# Altium schematic sheet DCAC_V2.SchDoc (part 2 of 3)
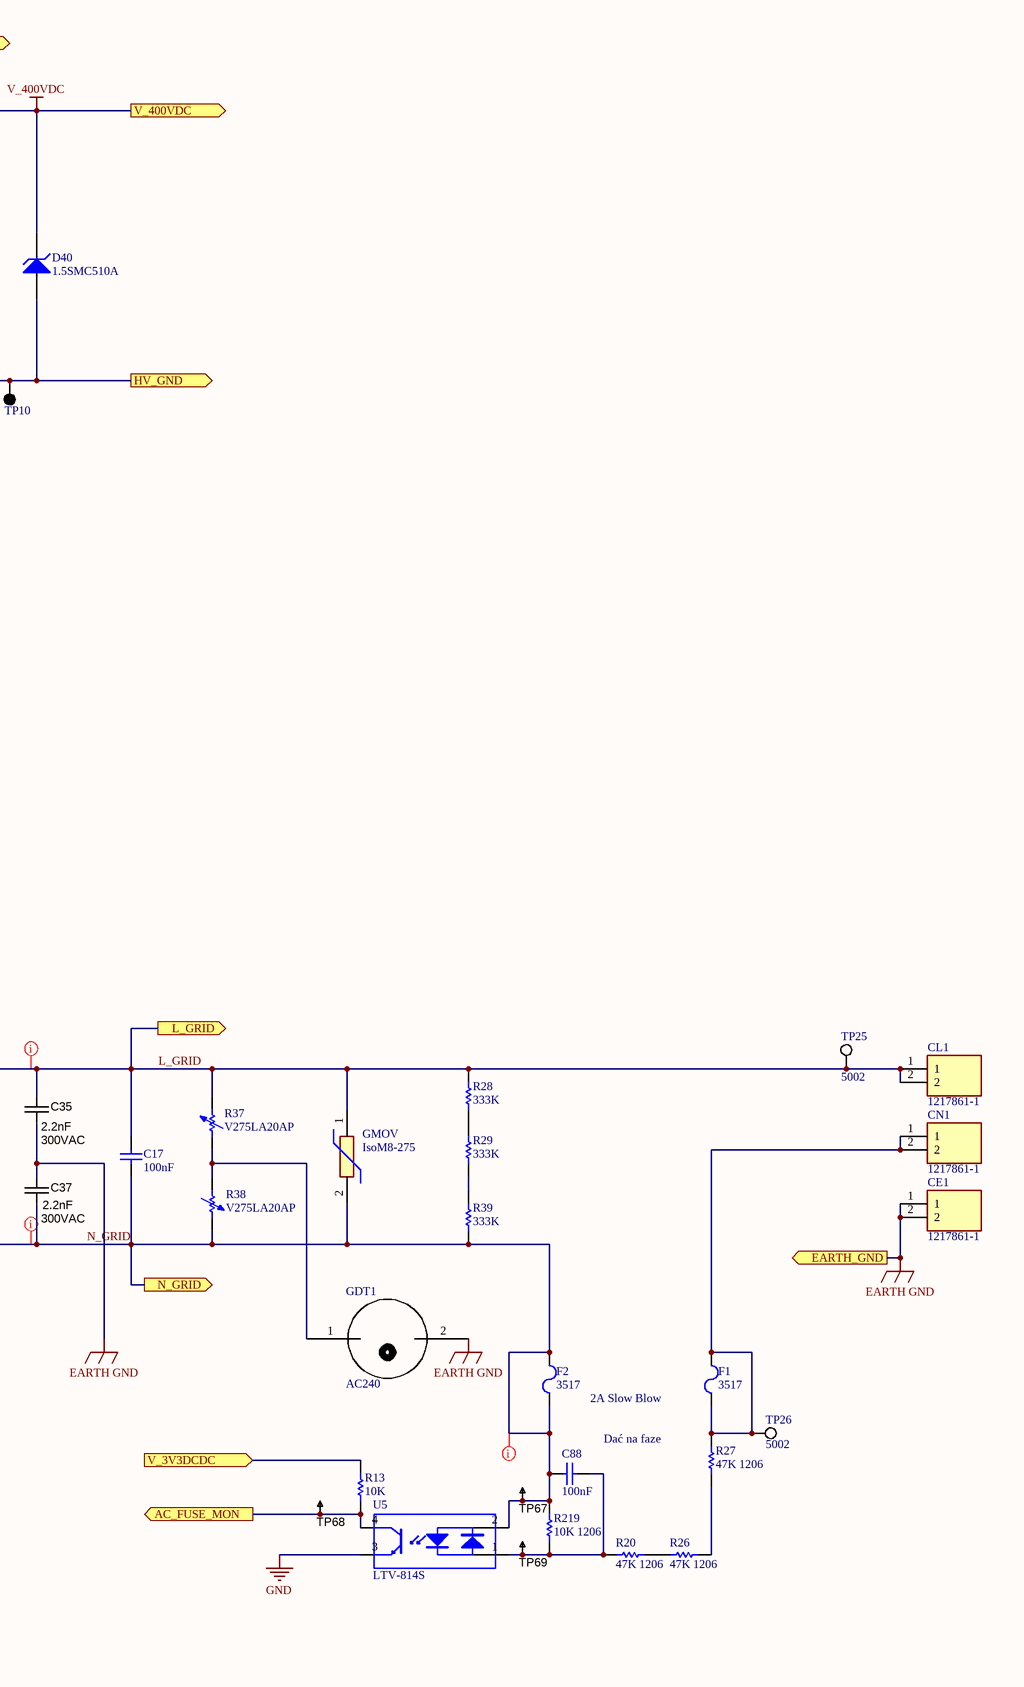
[diagram p2: DCAC_V2.SchDoc, right]
## Library data of the parts
C1-C4 = CAPMF_330n_TH_MPET_63VDC_10%: ECW-FE2W105K; Manufacturer: Panasonic; Manufacturer Part Number: ECWFE2W335J; Dielectric Material: PP; Tolerance: 5%; Supplier 1: Farnell; Supplier Part Number 1: 2805922; Stock 1: 358; RoHS: Yes; Mount: Through Hole; Case/Package: Radial; Min Operating Temperature: -40°C; Max Operating Temperature: 105°C; Packaging: Bulk; Capacitance: 1uF; Termination: PC Pins; Length: 1.024inch; Width: 0.394inch; Height - Seated (Max): 0.67inch; Lead Pitch: 0.886inch; ComponentLink1URL: https://industrial.panasonic.com/cdbs/www-data/pdf/RDI0000/DMI0000COL72.pdf?src-supplier=Digi-Key; ComponentLink1Description: https://industrial.panasonic.com/cdbs/www-data/pdf/RDI0000/DMI0000COL72.pdf?src-supplier=Digi-Key
C5 = C4AQLLW5360M36K: Capacitor; Manufacturer_Name: Kemet; Datasheet Link: https://www.kemet.com/specsheet/C4AQLLW5360M36K; Height: 24.2mm; Manufacturer_Part_Number: C4AQLLW5360M36K
C6 = CAPMF_330n_TH_MPET_63VDC_10%: Capacitor THD Metallized PP 45 uF, 500 VDC, -55/+105°C; Manufacturer: KEMET; Value: 45uF; ComponentLink1URL: http://www.epcos.com/inf/20/20/db/fc_2009/MKT_B32520_529.pdf; ComponentLink1Description: http://www.epcos.com/inf/20/20/db/fc_2009/MKT_B32520_529.pdf; Supplier 1: Newark; Supplier Part Number 1: 82AH0176; Manufacturer Part Number: C4AQLLW5450A38K; RoHS: Yes
C9 C149 = CMP-2006-02595-1: C0G ±5% 50V 100pF 0603 Multilayer Ceramic Capacitors MLCC - SMD/SMT ROHS; Part Number: GRM1885C1H101JA01D; Manufacturer: Murata; Temperature Coefficient: 30ppm/°C; Insulation Resistance: 10GR; Supplier 1: Digi-Key; Supplier Part Number 1: 490-1427-1-ND; Manufacturer Part Number: GRM1885C1H101JA01D; RoHS: Yes; Category: Ceramic Capacitors; Stock 1: 98306; Pricing 1: 1=0.10000, 10=0.06100, 50=0.03320, 100=0.02700, 500=0.01932, 1000=0.01518 (USD); Mount: Surface Mount; Case/Package: 0603; Number of Pins: 2; Case Code (Metric): 1608; Case Code (Imperial): 0603; Dielectric Material: Ceramic; Weight: 7.1E-05oz; Material: Ceramic; Min Operating Temperature: -55°C; Max Operating Temperature: 125°C; Capacitance: 100pF; Voltage Rating: 50V; Tolerance: 5%; Packaging: Tape and Reel; Package Quantity: 1; Voltage Rating (DC): 50V; Dielectric: C0G; Termination: SMD/SMT; Voltage: 50V; Length: 1.6mm; Width: 0.031inch; Height: 0.8mm; Thickness: 0.035inch; Depth: 0.8mm; Radiation Hardening: No; RoHS Compliant: Yes; REACH SVHC: Unknown; Lead Free: Lead Free; ComponentLink1URL: https://datasheet.ciiva.com/131/product-131088.pdf?src-supplier=Digi-Key; ComponentLink1Description: https://datasheet.ciiva.com/131/product-131088.pdf?src-supplier=Digi-Key; ComponentLink2URL: https://datasheet.ciiva.com/18100/getdatasheetpartid-26823-18100641.pdf?src-supplier=Verical; ComponentLink2Description: https://datasheet.ciiva.com/18100/getdatasheetpartid-26823-18100641.pdf?src-supplier=Verical; ComponentLink3URL: https://datasheet.ciiva.com/3777/grm1885c1h101ja0123-3777264.pdf?src-supplier=Arrow+Electronics; ComponentLink3Description: https://datasheet.ciiva.com/3777/grm1885c1h101ja0123-3777264.pdf?src-supplier=Arrow+Electronics; ComponentLink4URL: https://datasheet.ciiva.com/29149/450134-da-01-en-vs-kondensator-0603-29149008.pdf?src-supplier=Conrad; ComponentLink4Description: https://datasheet.ciiva.com/29149/450134-da-01-en-vs-kondensator-0603-29149008.pdf?src-supplier=Conrad; ComponentLink5URL: https://datasheet.ciiva.com/131/partnumbering-e-01-131089.pdf?src-supplier=Digi-Key; ComponentLink5Description: https://datasheet.ciiva.com/131/partnumbering-e-01-131089.pdf?src-supplier=Digi-Key; ComponentLink6URL: https://datasheet.ciiva.com/11605/c02e-11605557.pdf?src-supplier=Avnet; ComponentLink6Description: https://datasheet.ciiva.com/11605/c02e-11605557.pdf?src-supplier=Avnet; ComponentLink7URL: https://datasheet.ciiva.com/28556/4360-28556551.pdf?src-supplier=Element14; ComponentLink7Description: https://datasheet.ciiva.com/28556/4360-28556551.pdf?src-supplier=Element14; ComponentLink8URL: https://datasheet.ciiva.com/7828/4360-7828889.pdf?src-supplier=Element14; ComponentLink8Description: https://datasheet.ciiva.com/7828/4360-7828889.pdf?src-supplier=Element14; ComponentLink9URL: https://datasheet.ciiva.com/7828/4360-7828890.pdf?src-supplier=Element14; ComponentLink9Description: https://datasheet.ciiva.com/7828/4360-7828890.pdf?src-supplier=Element14; ComponentLink10URL: https://datasheet.ciiva.com/7828/4360-7828891.pdf?src-supplier=Element14; ComponentLink10Description: https://datasheet.ciiva.com/7828/4360-7828891.pdf?src-supplier=Element14; ComponentLink11URL: https://datasheet.ciiva.com/14116/grmseries-tc-hitype-eng-14116828.pdf?src-supplier=Distrelec; ComponentLink11Description: https://datasheet.ciiva.com/14116/grmseries-tc-hitype-eng-14116828.pdf?src-supplier=Distrelec; ComponentLink12URL: https://datasheet.ciiva.com/16291/product-16291613.pdf?src-supplier=Future+Electronics; ComponentLink12Description: https://datasheet.ciiva.com/16291/product-16291613.pdf?src-supplier=Future+Electronics; ComponentLink13URL: https://datasheet.ciiva.com/131/partnumbering-e-01-131087.pdf?src-supplier=Digi-Key; ComponentLink13Description: https://datasheet.ciiva.com/131/partnumbering-e-01-131087.pdf?src-supplier=Digi-Key; ComponentLink14URL: https://datasheet.ciiva.com/14116/grmseries-tc-hitype-eng-14116815.pdf?src-supplier=Distrelec; ComponentLink14Description: https://datasheet.ciiva.com/14116/grmseries-tc-hitype-eng-14116815.pdf?src-supplier=Distrelec; JLCPCB Part #: C14858
C10 = CMP-2000-07534-1: Chip Capacitor, 10 uF, +/- 20%, 100 V, -55 to 125 degC, 2220 (5750 Metric), RoHS, Tape and Reel; Manufacturer: AVX; Manufacturer Part Number: 22201C106MAT2A; Capacitance: 10uF; Voltage Rating: 100V; Dielectric: X7R; Datasheet URL: http://datasheets.avx.com/X7RDielectric.pdf; Package Reference: 2220; Package Description: 2-Pin Surface Mount Device, Body 5 x 5.7 mm; Datasheet Version: 03/2017; Manufacturer URL: http://www.avx.com/; Mounting Technology: SurfaceMount; Supplier 1: Digi-Key; Supplier Part Number 1: 478-9622-1-ND; Stock 1: 129916; Pricing 1: 1=2,26000, 10=1,82600, 100=1,39470 (USD); RoHS: Yes; Mount: Surface Mount; Case/Package: 2220; Case Code (Metric): 5750; Case Code (Imperial): 2220; Min Operating Temperature: -55°C; Max Operating Temperature: 125°C; Packaging: Tape and Reel; Tolerance: 20%; Voltage Rating (DC): 100V; Length: 0.224inch; Width: 0.197inch; Thickness: 0.11inch; ComponentLink1URL: http://catalogs.avx.com/SurfaceMount.pdf?src-supplier=Digi-Key; ComponentLink1Description: http://catalogs.avx.com/SurfaceMount.pdf?src-supplier=Digi-Key
C16 C17 = CMP-2000-05891-1: EMI Suppression Capacitor (MKP), 0.1 uF, +/- 10%, 305 V, 2-Pin THD, RoHS, Bulk B32922C3104K; Manufacturer: TDK; Other Names: 495-4476; Dielectric Material: Polypropylene; Voltage Rating - DC: 630V; Capacitance: 0.1µF; Dynamic Catalog: B32922Series; Voltage Rating - AC: 305V; Family: FilmCapacitors; Package / Case: Radial; Datasheet Version: 09/2016; Mounting Technology: ThroughHole; Package Reference: B32922C3104K; Datasheet URL: https://en.tdk.eu/inf/20/20/db/fc_2009/X2_B32921_928.pdf; Height - Seated (Max): 0.413"(10.50mm); Applications: EMISuppressionX2; Standard Package: 4,000; Package Description: 2-Pin Through Hole Device, Body 18 x 5 mm, Pitch 15 mm; Features: EMISuppression; Mounting Type: ThroughHole; Series: B32922; Category: Capacitors; Termination: PCPins; Size / Dimension: 0.709"Lx0.197"W(18.00mmx5.00mm); Operating Temperature: -40°C~110°C; Packaging: Bulk; Manufacturer URL: http://www.tdk.com/; Tolerance: ±10%; Lead Spacing: 0.591"(15.00mm)
C33 = CAPMF_330n_TH_MPET_63VDC_10%: MPX564K305G; Manufacturer 1: EPCOS Inc; Manufacturer Part Number 1: ECW-FE2W475P; Tolerance: ±10%; Material: Metallized Polyester; SCDType: source; Package / Case: Radial; Operating Temperature: -55°C ~ 125°C; ComponentLink1URL: http://www.epcos.com/inf/20/20/db/fc_2009/MKT_B32520_529.pdf; ComponentLink1Description: http://www.epcos.com/inf/20/20/db/fc_2009/MKT_B32520_529.pdf; Supplier 1: Digi-Key; Supplier Part Number 1: 495-2548-ND; Height - Seated (Max): 6.50mm; Lead Spacing: 5.00mm; Size / Dimension: 7.20mm L x 3.00mm W max; Value: 560nF
C35 C37 C188 C189 = CAPMF_330n_TH_MPET_63VDC_10%: B32021A3222K289; Manufacturer 1: EPCOS Inc; Manufacturer Part Number 1: ECW-FE2W475P; Tolerance: ±10%; Material: Metallized Polyester; SCDType: source; Package / Case: Radial; Operating Temperature: -55°C ~ 125°C; ComponentLink1URL: http://www.epcos.com/inf/20/20/db/fc_2009/MKT_B32520_529.pdf; ComponentLink1Description: http://www.epcos.com/inf/20/20/db/fc_2009/MKT_B32520_529.pdf; Supplier 1: Digi-Key; Supplier Part Number 1: 495-2548-ND; Height - Seated (Max): 6.50mm; Lead Spacing: 5.00mm; Size / Dimension: 7.20mm L x 3.00mm W max; Value: 2.2nF
C38 = CAP-NP-2: X5R ±10% 50V 10uF 1206 Multilayer Ceramic Capacitors MLCC - SMD/SMT ROHS; Manufacturer: AVX; Rated Voltage: 25V; Capacitance: 10µF; Mounting Technology: SurfaceMount; Package Reference: 1206; Tolerance (%): ±10%; Manufacturer URL: http://www.avx.com/; Datasheet URL: http://datasheets.avx.com/cx5r.pdf; Package Description: 2-Pin Surface Mount Device, Body 3.2 x 1.6 mm; Dielectric: X5R; Datasheet Version: 05/2016; Case Size/Dimension: 1206; JLCPCB Part #: C13585
C86 = CAP: X7R 1nF ±10% 50V 0603 Multilayer Ceramic Capacitors MLCC - SMD/SMT ROHS; Manufacturer: AVX Interconnect / Elco; Part Number: 06035A151JAT2A.; Manufacturer Part Number: 06035A151JAT2A; Capacitance: 100pF; Tolerance: 5%; Dielectric: C0G; Temperature Coefficient: 30ppm/°C; Insulation Resistance: 100GR; Supplier 1: Digi-Key; Supplier Part Number 1: 478-1177-1-ND; RoHS: Yes; Category: Ceramic Capacitors; Stock 1: 63714; Pricing 1: 1=0.12000, 10=0.08900, 100=0.04180, 500=0.02932, 1000=0.02428 (USD); Mount: Surface Mount,PCB; Case/Package: 0603; Number of Pins: 2; Case Code (Metric): 1608; Case Code (Imperial): 0603; Dielectric Material: Ceramic; Contact Plating: Tin,Matte; Min Operating Temperature: -55°C; Max Operating Temperature: 125°C; Voltage Rating (DC): 50V; Voltage Rating: 50V; Packaging: Tape and Reel; Package Quantity: 1; Termination: SMD/SMT; Voltage: 50V; Length: 1.6mm; Height: 0.86mm; Width: 0.032inch; Depth: 0.81mm; Thickness: 0.035inch; Radiation Hardening: No; Lead Free: Lead Free; REACH SVHC: No SVHC; ComponentLink1URL: https://datasheet.ciiva.com/1124/84496-1124721.pdf?src-supplier=Element14; ComponentLink1Description: https://datasheet.ciiva.com/1124/84496-1124721.pdf?src-supplier=Element14; ComponentLink2URL: https://datasheet.ciiva.com/2987/ccog-2987781.pdf?src-supplier=Avnet; ComponentLink2Description: https://datasheet.ciiva.com/2987/ccog-2987781.pdf?src-supplier=Avnet; ComponentLink3URL: https://datasheet.ciiva.com/7855/759117-7855061.pdf?src-supplier=Element14; ComponentLink3Description: https://datasheet.ciiva.com/7855/759117-7855061.pdf?src-supplier=Element14; ComponentLink4URL: https://datasheet.ciiva.com/2987/ccog-2987782.pdf?src-supplier=Avnet; ComponentLink4Description: https://datasheet.ciiva.com/2987/ccog-2987782.pdf?src-supplier=Avnet; ComponentLink5URL: https://datasheet.ciiva.com/156/ccog-156216.pdf?src-supplier=Digi-Key; ComponentLink5Description: https://datasheet.ciiva.com/156/ccog-156216.pdf?src-supplier=Digi-Key; ComponentLink6URL: https://datasheet.ciiva.com/156/ccog-156217.pdf?src-supplier=Digi-Key; ComponentLink6Description: https://datasheet.ciiva.com/156/ccog-156217.pdf?src-supplier=Digi-Key; ComponentLink7URL: https://datasheet.ciiva.com/156/ccog-156218.pdf?src-supplier=Digi-Key; ComponentLink7Description: https://datasheet.ciiva.com/156/ccog-156218.pdf?src-supplier=Digi-Key; ComponentLink8URL: https://datasheet.ciiva.com/16300/ccog-16300429.pdf?src-supplier=Future+Electronics; ComponentLink8Description: https://datasheet.ciiva.com/16300/ccog-16300429.pdf?src-supplier=Future+Electronics; ComponentLink9URL: https://datasheet.ciiva.com/22699/84496-22699966.pdf?src-supplier=Element14; ComponentLink9Description: https://datasheet.ciiva.com/22699/84496-22699966.pdf?src-supplier=Element14; ComponentLink10URL: https://datasheet.ciiva.com/5418/ccog-5418335.pdf?src-supplier=Mouser; ComponentLink10Description: https://datasheet.ciiva.com/5418/ccog-5418335.pdf?src-supplier=Mouser; ComponentLink11URL: https://datasheet.ciiva.com/16538/ccog-16538111.pdf?src-supplier=Avnet+Asia; ComponentLink11Description: https://datasheet.ciiva.com/16538/ccog-16538111.pdf?src-supplier=Avnet+Asia; Parameter 1: *; JLCPCB Part #: C1588; Parameter 2: *
C88 C116 = CAP: X7R 100nF ±10% 50V 0603 Multilayer Ceramic Capacitors MLCC - SMD/SMT ROHS; Part Number: GCM188R72A104KA64D; Manufacturer: Murata; Manufacturer Part Number: CC0603KRX7R9BB104; Voltage Rating: 100V; Supplier 1: Arrow Electronics; Supplier Part Number 1: GCM188R72A104KA64D; RoHS: Yes; Category: Ceramic Capacitors; Mount: Surface Mount; Case/Package: 0603; Case Code (Imperial): 0603; Case Code (Metric): 1608; Min Operating Temperature: -55°C; Max Operating Temperature: 125°C; Tolerance: 10%; Packaging: Tape and Reel; Capacitance: 100nF; Dielectric: X7R; Termination: SMD/SMT; Voltage Rating (DC): 100V; Length: 1.6mm; Height: 0.8mm; Depth: 0.8mm; Radiation Hardening: No; ComponentLink1URL: https://datasheet.ciiva.com/17451/product-17451047.pdf?src-supplier=Avnet+Europe; ComponentLink1Description: https://datasheet.ciiva.com/17451/product-17451047.pdf?src-supplier=Avnet+Europe; ComponentLink2URL: https://datasheet.ciiva.com/26889/getdatasheetpartid-387765-26889164.pdf?src-supplier=Verical; ComponentLink2Description: https://datasheet.ciiva.com/26889/getdatasheetpartid-387765-26889164.pdf?src-supplier=Verical; Parameter 1: *; JLCPCB Part #: C14663
C134 C187 = CAP: CAP 100nF 630V ±10% 1812 (4532 Metric) Thickness 2.3mm SMD; Case-Metric: 4532; Case-EIA: 1812; Tolerance: Â±10%; Value: 100nF; Rated Voltage: 630 V; Max Thickness: 2.3 mm; Technology: SMT
CE1 CL1 CN1 = 1217861-1: Connector; Manufacturer_Name: TE Connectivity; Datasheet Link: http://docs-emea.rs-online.com/webdocs/1278/0900766b812785e3.pdf; Manufacturer_Part_Number: 1217861-1; Mouser Part Number: 571-1217861-1; Mouser Price/Stock: https://www.mouser.co.uk/ProductDetail/TE-Connectivity-AMP/1217861-1/?qs=YkfQu37F2pOh5mJSH68dJA%3D%3D; Arrow Part Number: 1217861-1; Arrow Price/Stock: https://www.arrow.com/en/products/1217861-1/te-connectivity
CMC1 = CMC_2K2_100M_3216-SMD: Common Mode Choke 2.2K Ohm 1206 SMD; Manufacturer 1: Wurth Electronics Inc; Manufacturer Part Number 1: 744232222; Impedance: 2200 Ohm at 100 MHz; Ratings: 2.2k Ohms at 100MHz; SCDType: source; PackageDescription: SMD Inductor, 4-Leads, Body 1.8 x 3.4 mm; Supplier 1: Digi-Key; Supplier Part Number 1: 732-1474-1-ND; ComponentLink1URL: http://katalog.we-online.de/kataloge/eisos/media/pdf/744232222.pdf; ComponentLink1Description: 744232222 datasheet; Package / Case: Horizontal, 4 PC Pad; Height (Max): 0.083" (2.10mm)
D3 D4 = CMP-1161-00003-1: 3rd Generation ThinQ SiC Schottky Diode, -55 to 175 degC, PG-TO220-2-1, Tube, Green; Manufacturer: Infineon; ComponentLink1Description: Manufacturer URL; ComponentLink2Description: Datasheet; ComponentLink3URL: http://www.infineon.com/dgdl/IDP09E120_v2_3G%5B1%5D.pdf?folderId=db3a304314dca38901151224afae0c96&fileId=db3a30432313ff5e01237a7d849d7c11; ComponentLink1URL: http://www.infineon.com/; ComponentLink3Description: Package Specification; ComponentLink2URL: http://www.infineon.com/dgdl/IDH06SG60C_rev2.4.pdf?folderId=db3a30431ddc9372011ed0010fda1bd3&fileId=db3a30431ed1d7b2011eee0cadfb545a; Supplier 1: Digi-Key; Supplier Part Number 1: IDH06G65C6XKSA1-ND; Manufacturer Part Number: IDH06G65C6XKSA1; Stock 1: 1521; Pricing 1: 1=2,68000, 10=2,41000, 100=1,97460, 500=1,68092, 1000=1,41764 (USD); RoHS: No; ComponentLink4URL: https://www.infineon.com/dgdl/Infineon-IDH06G65C6-DS-v02_00-EN.pdf?fileId=5546d4625cc9456a015cd4d37d7a2df6&src-supplier=Digi-Key; ComponentLink4Description: https://www.infineon.com/dgdl/Infineon-IDH06G65C6-DS-v02_00-EN.pdf?fileId=5546d4625cc9456a015cd4d37d7a2df6&src-supplier=Digi-Key
D8 D10 D13-D17 D20 = CMP-1063-00102-1: Transient Voltage Suppressor, Micro-Packaged Diode for ESD Protection, 2-Pin SOD-523, Pb-Free, Tape and Reel; Manufacturer: On Semiconductor; PartNumber: ESD5Z5.0T1G; V(BR) Min (V): 6.2; VRWM Max (V): 5; Number of Lines: 1; PPK Max (W): 174; IR Max (uA): 0.05; Direction: Unidirectional; PackageVersion: Rev. E, 09/2010; Mounting Technology: Surface Mount; Packing: Tape and Reel; ComponentLink2URL: http://www.onsemi.cn/pub_link/Collateral/ESD5Z2.5T1-D.PDF; ComponentLink2Description: Datasheet; PackageReference: SOD-523-2-502-01; ComponentLink1Description: Manufacturer URL; ComponentLink3URL: http://www.onsemi.com/pub_link/Collateral/502-01.PDF; PackageDescription: 2-Pin SOD, Body 1.2 x 0.8 mm; ComponentLink3Description: Package Specification; ComponentLink1URL: http://www.onsemi.com/; RoHS: Pb-Free; DatasheetVersion: Rev. 10
D18 = CMP-1060-00300-1: Zener Voltage Regulator, 500 mW, 2-Pin SOD-123, Pb-Free, Tape and Reel; Manufacturer: On Semiconductor; VZ Typ (V): 15; P Max (W): 0.5; PackageDescription: 2-Pin SOD, Body 1.6 x 2.69 mm; DatasheetVersion: Rev. 9; Packing: Tape and Reel; ComponentLink2URL: http://www.onsemi.com/pub_link/Collateral/MMSZ4678T1-D.PDF; ComponentLink3URL: http://www.onsemi.com/pub_link/Collateral/425-04.PDF; ComponentLink1Description: Manufacturer URL; ComponentLink1URL: http://www.onsemi.com/; RoHS: Pb-Free; Mounting Technology: Surface Mount; ComponentLink2Description: Datasheet; PackageVersion: Rev. G, 10/2009; PackageReference: SOD-123-2-425-04; PartNumber: SZMMSZ4702T1G; ComponentLink3Description: Package Specification
D19 = CMP-0303-00003-1: 1.1V 1A 10uA 1kV 1kV - 1A SOD-123FL Diodes - General Purpose ROHS; PartNumber: 1N5819HW-7-F; Manufacturer: Diodes Inc; @ VR (V): 40; @ Terminal Temperature TT (degC): 90; Maximum Average Rectified Current IO (A): 1; Total Capacitance CT (pF): 50; Peak Forward Surge Current IFSM (A): 25; Forward Voltage Drop VF (V): 0.45; Packing: Tape and Reel; VR (RMS) (V): 28; RoHS: TRUE; ComponentLink2URL: http://www.diodes.com/datasheets/ds30217.pdf; PackageDescription: 2-Pin SOD-123, Body 2.7 x 1.55 mm, Pitch 3.7 mm; @ IF (A): 1; Operating and Storage Temperature Range: -65 to 125 degC; ComponentLink1Description: Manufacturer URL; ComponentLink2Description: Datasheet; ComponentLink1URL: http://www.diodes.com/; Mounting Technology: Surface Mount; DatasheetVersion: Rev. 15-2; PackageReference: SOD-123-2; Maximum Reverse Current IR (uA): 50; Peak Repetitive Reverse Voltage VRRM (V): 40; JLCPCB Part #: C64898
D39 = CMP-08607-000117-1: TVS DIODE 376V 602V DO214AB; Manufacturer: Littelfuse; Peak Pulse Power: 1.5kW; Number of Bidirectional Channels: 1; Min Breakdown Voltage: 418V; Power Line Protection: No; Polarity: Bidirectional; Peak Pulse Current: 2.5A; Max Breakdown Voltage: 462V; Test Current: 1mA; Max Reverse Leakage Current: 1uA; Max Power Dissipation: 6.5W; Element Configuration: Single; Leakage Current: 5uA; Voltage Rating (DC): 440V; Diode Type: ZENER; Supplier 1: Digi-Key; Supplier Part Number 1: 1.5SMC440CACT-ND; Manufacturer Part Number: 1.5SMC440CA; RoHS: Yes; Category: TVS Diodes; Stock 1: 11544; Pricing 1: 1=0.98000, 10=0.87600, 100=0.68340, 500=0.56450, 1000=0.44566 (USD); Mount: Surface Mount; Case/Package: DO-214AB; Number of Pins: 2; Min Operating Temperature: -65°C; Max Operating Temperature: 150°C; Clamping Voltage: 602V; Packaging: Tape and Reel; Reverse Standoff Voltage: 376V; Breakdown Voltage: 418V; Resistor Type: Zener; Direction: Bidirectional; Package Quantity: 3000; Number of Elements: 1; Reverse Breakdown Voltage: 418V; Operating Supply Voltage: 376V; Max Surge Current: 2.5A; Number of Channels: 1; Termination: SMD/SMT; Power Dissipation: 1.5kW; Series: 1.5SMC; Clamping Voltage-Max: 602V; Length: 7.11mm; Width: 6.22mm; Height: 2.417mm; Radiation Hardening: No; RoHS Compliant: Yes; REACH SVHC: Unknown; Lead Free: Lead Free; ComponentLink1URL: https://datasheet.ciiva.com/26948/getdatasheetpartid-789195-26948227.pdf?src-supplier=Verical; ComponentLink1Description: https://datasheet.ciiva.com/26948/getdatasheetpartid-789195-26948227.pdf?src-supplier=Verical; ComponentLink2URL: https://datasheet.ciiva.com/332/littelfuse-tvs-diode-1-5smc-datasheet-pdf-332643.pdf?src-supplier=Digi-Key; ComponentLink2Description: https://datasheet.ciiva.com/332/littelfuse-tvs-diode-1-5smc-datasheet-pdf-332643.pdf?src-supplier=Digi-Key; ComponentLink3URL: https://datasheet.ciiva.com/332/littelfuse-tvs-diode-1-5smc-datasheet-pdf-332644.pdf?src-supplier=Digi-Key; ComponentLink3Description: https://datasheet.ciiva.com/332/littelfuse-tvs-diode-1-5smc-datasheet-pdf-332644.pdf?src-supplier=Digi-Key; ComponentLink4URL: https://datasheet.ciiva.com/332/littelfuse-tvs-diode-1-5smc-datasheet-pdf-332645.pdf?src-supplier=Digi-Key; ComponentLink4Description: https://datasheet.ciiva.com/332/littelfuse-tvs-diode-1-5smc-datasheet-pdf-332645.pdf?src-supplier=Digi-Key; ComponentLink5URL: https://datasheet.ciiva.com/1275/littelfuse-tvs-diodes-1-5smc-1275687.pdf?src-supplier=Element14; ComponentLink5Description: https://datasheet.ciiva.com/1275/littelfuse-tvs-diodes-1-5smc-1275687.pdf?src-supplier=Element14
D40 = CMP-2000-07108-1: Transient Voltage Suppressor, 1500 W, 434 V, 2-Pin SMD, RoHS, Tape and Reel; Manufacturer: Littelfuse; Clamping Voltage: 725V; Peak Pulse Power: 1.5kW; Number of Unidirectional Channels: 1; Reverse Standoff Voltage: 477V; Min Breakdown Voltage: 503.5V; Power Line Protection: No; Peak Pulse Current: 2.1A; Polarity: Unidirectional; Voltage Rating (DC): 530V; Diode Type: ZENER; Supplier 1: Digi-Key; Supplier Part Number 1: 18-1.5SMC530ACT-ND; Manufacturer Part Number: 1.5SMC510A; RoHS: Yes; Category: TVS Diodes; Stock 1: 3000; Pricing 1: 1=0.90000, 10=0.80300, 100=0.62600, 500=0.51710, 1000=0.40824 (USD); Mount: Surface Mount; Case/Package: DO-214AB; Min Operating Temperature: -65°C; Max Operating Temperature: 150°C; Packaging: Tape and Reel; Resistor Type: Zener; Package Quantity: 3000; Operating Supply Voltage: 477V; Max Surge Current: 2.1A; Breakdown Voltage: 503.5V; Number of Channels: 1; Termination: SMD/SMT; Series: 1.5SMC; Length: 8.13mm; Width: 6.22mm; Height: 2.62mm; RoHS Compliant: Yes; Lead Free: Lead Free; ComponentLink1URL: https://datasheet.ciiva.com/349/littelfuse-tvs-diode-1-5smc-datasheet-pdf-349735.pdf?src-supplier=Digi-Key; ComponentLink1Description: https://datasheet.ciiva.com/349/littelfuse-tvs-diode-1-5smc-datasheet-pdf-349735.pdf?src-supplier=Digi-Key
F1 F2 = CMP-0956-00001-1: Straight PC Leg Fuse Clip-W/O Orientation Leg P/N, 15 A, 2-Pin THD; Manufacturer: Keystone; Current Rating: 15 A; UL Recognized: Yes; Style: CLIP; Fuse Type: Cylindrical; Fuse Entry: Vertical; Mounting Technology: Through Hole; ComponentLink1URL: http://www.keyelco.com/; ComponentLink2Description: Datasheet; PackageReference: 3517-2; ComponentLink1Description: Manufacturer URL; ComponentLink2URL: http://www.keyelco.com/product-pdf.cfm?p=354; DatasheetVersion: Rev. E; PartNumber: 3517; PackageDescription: 2-Pin THD, Pin Spacing 6.76 mm, Height 8.71 mm
F3 = 0678H9100-02: Fuse; Manufacturer_Name: Bel; Datasheet Link: https://www.mouser.com/datasheet/2/643/Bel Fuse_02202018_0678H-1288534.pdf; Height: 3.18mm; Manufacturer_Part_Number: 0678H9100-02; Mouser Part Number: 530-0678H9100-02
GDT1 = AC240: GDT 240VAC 10KA THROUGH HOLE; Manufacturer: Littelfuse; Manufacturer Part Number: AC240L; Number of Poles: 2; Voltage Rating: 240V; Peak Pulse Current: 10A; Max Breakdown Voltage: 715V; Min Breakdown Voltage: 425V; Fail Short: No; Capacitance: 1pF; Supplier 1: Digi-Key; RoHS: Yes; Category: Uncategorized; Stock 1: 1428; Pricing 1: 1=3.08000, 5=2.93200, 10=2.78400, 50=2.24720, 100=1.90520, 350=1.85631, 700=1.56320, 1050=1.39223, 5250=1.22125 (USD); Mount: Through Hole,Axial,Plug-In; Number of Pins: 2; Min Operating Temperature: -40°C; Max Operating Temperature: 125°C; Package Quantity: 350; Packaging: Tray; Termination: Axial; Breakdown Voltage: 715V; Length: 6.07mm; Height: 8mm; Lead Free: Lead Free; REACH SVHC: Unknown; ComponentLink1URL: https://datasheet.ciiva.com/25606/0900766b81123301-25606550.pdf?src-supplier=RSComponents; ComponentLink1Description: https://datasheet.ciiva.com/25606/0900766b81123301-25606550.pdf?src-supplier=RSComponents; ComponentLink2URL: https://datasheet.ciiva.com/15226/getdatasheetpartid-76877-15226854.pdf?src-supplier=Verical; ComponentLink2Description: https://datasheet.ciiva.com/15226/getdatasheetpartid-76877-15226854.pdf?src-supplier=Verical; ComponentLink3URL: https://datasheet.ciiva.com/323/littelfuse-gdt-ac-cg3-series-323306.pdf?src-supplier=Digi-Key; ComponentLink3Description: https://datasheet.ciiva.com/323/littelfuse-gdt-ac-cg3-series-323306.pdf?src-supplier=Digi-Key; ComponentLink4URL: https://datasheet.ciiva.com/22727/littelfuse-src-gdt-ac-series-r1-22727434.pdf?src-supplier=Element14; ComponentLink4Description: https://datasheet.ciiva.com/22727/littelfuse-src-gdt-ac-series-r1-22727434.pdf?src-supplier=Element14; ComponentLink5URL: https://datasheet.ciiva.com/18416/70184210-18416011.pdf?src-supplier=Allied+Electronics; ComponentLink5Description: https://datasheet.ciiva.com/18416/70184210-18416011.pdf?src-supplier=Allied+Electronics; ComponentLink6URL: https://datasheet.ciiva.com/1272/447910-1272796.pdf?src-supplier=Element14; ComponentLink6Description: https://datasheet.ciiva.com/1272/447910-1272796.pdf?src-supplier=Element14; Supplier Part Number 1: F2725-ND
GMOV = GMOV-20D271K: Varistor; Manufacturer_Name: Bourns; Datasheet Link: https://media.digikey.com/pdf/Data%20Sheets/Bourns%20PDFs/GMOV_Series_DS.pdf; Height: 26mm; Manufacturer_Part_Number: GMOV-20D271K; Mouser Part Number: 652-GMOV-20D271K; Mouser Price/Stock: https://www.mouser.co.uk/ProductDetail/Bourns/GMOV-20D271K?qs=vLWxofP3U2wqBB3%2FsR%252BZvw%3D%3D; Arrow Part Number: GMOV-20D271K; Arrow Price/Stock: https://www.arrow.com/en/products/gmov-20d271k/bourns
GRID_ON = CMP-1426-00002-1: SMD mono-color Chip LED, WL-SMCW, Green; Manufacturer: Wuerth Elektronik; ComponentLink1URL: http://www.we-online.com; ComponentLink2Description: Datasheet; Color: Green; ComponentLink2URL: http://katalog.we-online.com/led/datasheet/150060GS75000.pdf; PartNumber: 150060GS75000; PackageReference: 0603_A; ComponentLink1Description: Manufacturer URL
J6 = CLP-104-02-F-D-BE: Connector; Manufacturer_Name: SAMTEC; Datasheet Link: http://suddendocs.samtec.com/prints/erm8-xxx-xx.x-xxx-dv-xxxx-xx-mkt.pdf; Manufacturer_Part_Number: CLP-104-02-F-D-BE; Mouser Part Number: 200-CLP10402FDBE; Mouser Price/Stock: https://www.mouser.co.uk/ProductDetail/Samtec/CLP-104-02-F-D-BE?qs=0lQeLiL1qybJIh6Z%2F3PMbA%3D%3D; Arrow Part Number: CLP-104-02-F-D-BE; Arrow Price/Stock: https://www.arrow.com/en/products/clp-104-02-f-d-be/samtec
K1 = CMP-1503-00190-1: LQ Relays, 12 V Coil Voltage, 200 mW Nominal Operating Power, -40 to 85 degC, 4-Pin LQ, Carton, Case, RoHS; Manufacturer: Panasonic; Pb-Free: True; Nominal Operating Power: 200 mW; Max Switching Current: 10 A (N.O.), 3 A (N.C.); Electrical Life: 5x10^4; Coil Voltage: 12 V; Mechanical Life(Min.operation): 1x10^7; Max Switching Voltage: 250 V AC; Mounting Technology: Through Hole; ComponentLink3URL: http://www3.panasonic.biz/ac/e_download/control/relay/power/catalog/mech_eng_lq.pdf?f_cd=401220; Series: LQ Relays; Packing: Carton, Case; RoHS: True; PackageVersion: ASCTB92E, 10/2014; ComponentLink1URL: http://www3.panasonic.biz/ac/ae/index.jsp; PartNumber: ALQ312; PackageReference: LQ-4-2000x1000x1600; PackageDescription: 4-Pin Through Hole Terminal Package, Body 20 x 10 mm; ComponentLink2URL: http://www3.panasonic.biz/ac/e_download/control/relay/power/catalog/mech_eng_lq.pdf?f_cd=401220; ComponentLink3Description: Package Specification; ComponentLink2Description: Datasheet; ComponentLink1Description: Manufacturer URL; DatasheetVersion: 201410-T
L2 L3 = INDC_150n_1008: Inductor SMD chip 150nH 1008; Manufacturer 1: TDK Corporation; Manufacturer Part Number 1: NLV25T-R15J-PF; Ratings: 500 mA; Tolerance: ±5%; SCDType: spec; Package / Case: 1008 (2520 Metric); Supplier 1: Digi-Key; Supplier Part Number 1: 445-1715-1-ND; Value: 1mH
Q3 = CMP-0434-00001-1: N-Channel Enhancement Mode Field Effect Transistor, 60 V, 0.115 A, -55 to 150 degC, 3-Pin SOT23, RoHS, Tape and Reel; Manufacturer: STMicroelectronics; PartNumber: 2N7002; ComponentLink2Description: Datasheet; ComponentLink2URL: http://www.st.com/st-web-ui/static/active/en/resource/technical/document/datasheet/CD00005134.pdf; ComponentLink1Description: Manufacturer URL; ComponentLink1URL: http://www.st.com/; DatasheetVersion: Rev. 9, 11/2008; PackageReference: SOT-23; Mounting Technology: Surface Mount; PackageDescription: 3-Pin SOT23, 3.016 x 2.8 mm Body, 0.95 mm Pitch; JLCPCB Part #: C8545
Q16 = STM-NEMOS-G1S2D3-3: N-Channel Enhancement Mode Field Effect Transistor, 60 V, 0.115 A, -55 to 150 degC, 3-Pin SOT23, RoHS, Tape and Reel; Manufacturer: STMicroelectronics; PartNumber: 2N7002; ComponentLink2Description: Datasheet; ComponentLink2URL: http://www.st.com/st-web-ui/static/active/en/resource/technical/document/datasheet/CD00005134.pdf; ComponentLink1Description: Manufacturer URL; ComponentLink1URL: http://www.st.com/; DatasheetVersion: Rev. 9, 11/2008; PackageReference: SOT-23; Mounting Technology: Surface Mount; PackageDescription: 3-Pin SOT23, 3.016 x 2.8 mm Body, 0.95 mm Pitch; JLCPCB Part #: C8545
Q17 Q23 = CMP-1166-00047-1: 600 V IGBT in TrenchStop and Fieldstop Technology with Soft, Fast Recovery Anti-Parallel EmCon HE Diode, 80 A IC, -40 to 175 degC, PG-TO247-3, Tube, Green; Manufacturer: Infineon; Manufacturer Part Number: IKW30N65EL5XKSA1; Collector Emitter Voltage (VCEO): 650V; Max Collector Current: 85A; Max Power Dissipation: 227W; Reverse Recovery Time: 100ns; Element Configuration: Single; Switching Frequency: 50Hz; Supplier 1: Digi-Key; Supplier Part Number 1: IKW30N65EL5XKSA1IN-ND; Stock 1: 503; Pricing 1: 1=5,78000, 10=5,19000, 100=4,25220, 500=3,61986, 1000=3,05290 (USD); RoHS: Yes; Mount: Through Hole; Case/Package: TO-247; Number of Pins: 3; Min Operating Temperature: -40°C; Max Operating Temperature: 175°C; Packaging: Rail/Tube; Collector Emitter Breakdown Voltage: 650V; Lead Free: Lead Free; Halogen Free: Halogen Free; ComponentLink1URL: http://www.mouser.com/ds/2/196/Infineon-IKW30N65EL5-DS-v02_01-EN-534334.pdf?src-supplier=Mouser; ComponentLink1Description: http://www.mouser.com/ds/2/196/Infineon-IKW30N65EL5-DS-v02_01-EN-534334.pdf?src-supplier=Mouser; ComponentLink2URL: http://www.infineon.com/dgdl/Infineon-IKW30N65EL5-DS-v02_01-EN.pdf?fileId=5546d4624b0b249c014b11cd5d3c3acb&src-supplier=Digi-Key; ComponentLink2Description: http://www.infineon.com/dgdl/Infineon-IKW30N65EL5-DS-v02_01-EN.pdf?fileId=5546d4624b0b249c014b11cd5d3c3acb&src-supplier=Digi-Key; ComponentLink3URL: http://www.infineon.com/dgdl/Infineon-IKW30N65EL5-DS-v02_01-EN.pdf?fileId=5546d4624b0b249c014b11cd5d3c3acb&src-supplier=Avnet; ComponentLink3Description: http://www.infineon.com/dgdl/Infineon-IKW30N65EL5-DS-v02_01-EN.pdf?fileId=5546d4624b0b249c014b11cd5d3c3acb&src-supplier=Avnet
Q24 Q25 = CMP-2000-06042-1: Silicon Carbide Power MOSFET C2M(TM) MOSFET Technology, 1200 V, 90 A, -55 to 150 degC, 3-Pin TO-247, RoHS, Tube; Manufacturer: Cree,Inc.; Qg - Gate Charge: 406nC; Trr: 32ns; Fall Time: 28.4ns; Rise Time: 31.6ns; Vds - Drain-Source Breakdown Voltage: 1200V; Id: 90A; Vgs th - Gate-Source Threshold Voltage: 2.4V; Unit Weight: 1.340411oz; Typical Turn-On Delay Time: 14.4ns; Pd - Power Dissipation: 463W; Configuration: Single; Typical Turn-Off Delay Time: 28.8ns; Vgss: 20V; Transistor Polarity: N-Channel; Rds On - Drain-Source Resistance: 25mOhms; Vth: 2.6V; Forward Transconductance - Min: 23.6S; Number of Channels: 1Channel; Transistor Type: 1N-Channel; RDS(on): 0.025Ohm; Channel Mode: Enhancement; Vgs - Gate-Source Voltage: -10V,+25V; Product: PowerMOSFET; Datasheet URL: http://www.wolfspeed.com/media/downloads/161/C2M0025120D.pdf; Packaging: Tube; Package Reference: TO-247-3; Manufacturer URL: http://www.cree.com/; Product Category: MOSFET; Factory Pack Quantity: 30; Height: 21.1mm; Minimum Operating Temperature: -55C; Datasheet Version: Rev. B, 10/2015; Type: SiliconCarbidePowerMOSFET; Technology: SiC; Length: 5.21mm; Width: 16.13mm; Vdss: 1200V; Brand: Cree,Inc.; Mounting Technology: ThroughHole; Package / Case: TO-247-3; RoHS: True; Package Description: 3-Pin Flange Mount, Vertical Straight Lead, Body 15.94 x 5.02 mm, Pitch 5.44 mm; Maximum Operating Temperature: +150C; Mounting Style: ThroughHole; Id - Continuous Drain Current: 90A
R2 = CMP-2003-00835-1: ±1% 100kΩ ±100ppm/℃ 0.25W 1206 Chip Resistor - Surface Mount ROHS; Manufacturer: Panasonic; Part Number: ERJ8ENF3302V; Manufacturer Part Number: ERJ-8ENF3302V; Resistance: 33kR; Temperature Coefficient: 100ppm/°C; Power Rating: 250mW; Voltage Rating: 200V; Supplier 1: Newark; Supplier Part Number 1: 73AC7929; RoHS: Yes; Category: Chip SMD Resistors; Stock 1: 95000; Pricing 1: 5000=0.01400, 10000=0.01300 (USD); Mount: Surface Mount; Case/Package: 1206; Number of Pins: 2; Case Code (Metric): 3216; Case Code (Imperial): 1206; Contact Plating: Tin; Weight: 0.000571oz; Min Operating Temperature: -55°C; Max Operating Temperature: 155°C; Tolerance: 1%; Packaging: Tape and Reel; Resistor Type: Thick Film; Series: ERJ; Number of Terminations: 2; Max Power Dissipation: 250mW; Construction: Rectangular; Termination: SMD/SMT; Resistance Tolerance: 1%; Technology: THICK FILM; Length: 3.2mm; Width: 0.063inch; Height: 0.6mm; Depth: 1.6mm; Radiation Hardening: No; RoHS Compliant: Yes; Military Standard: Not; REACH SVHC: No SVHC; ComponentLink1URL: https://datasheet.ciiva.com/7802/1678782-7802698.pdf?src-supplier=Element14; ComponentLink1Description: https://datasheet.ciiva.com/7802/1678782-7802698.pdf?src-supplier=Element14; ComponentLink2URL: https://datasheet.ciiva.com/22687/1678782-22687084.pdf?src-supplier=Element14; ComponentLink2Description: https://datasheet.ciiva.com/22687/1678782-22687084.pdf?src-supplier=Element14; ComponentLink3URL: https://datasheet.ciiva.com/9190/aoa0000ce2-9190686.pdf?src-supplier=Avnet; ComponentLink3Description: https://datasheet.ciiva.com/9190/aoa0000ce2-9190686.pdf?src-supplier=Avnet; ComponentLink4URL: https://datasheet.ciiva.com/7802/426256-7802463.pdf?src-supplier=Element14; ComponentLink4Description: https://datasheet.ciiva.com/7802/426256-7802463.pdf?src-supplier=Element14; ComponentLink5URL: https://datasheet.ciiva.com/16758/70260748-16758335.pdf?src-supplier=Allied+Electronics; ComponentLink5Description: https://datasheet.ciiva.com/16758/70260748-16758335.pdf?src-supplier=Allied+Electronics; ComponentLink6URL: https://datasheet.ciiva.com/24168/aoa0000ce2-24168303.pdf?src-supplier=Mouser; ComponentLink6Description: https://datasheet.ciiva.com/24168/aoa0000ce2-24168303.pdf?src-supplier=Mouser; ComponentLink7URL: https://datasheet.ciiva.com/30215/aoa0000ce2-30215919.pdf?src-supplier=Onlinecomponents.com; ComponentLink7Description: https://datasheet.ciiva.com/30215/aoa0000ce2-30215919.pdf?src-supplier=Onlinecomponents.com; ComponentLink8URL: https://datasheet.ciiva.com/46436/1678782-46436639.pdf?src-supplier=Element14; ComponentLink8Description: https://datasheet.ciiva.com/46436/1678782-46436639.pdf?src-supplier=Element14
R3 R13 = CMP-1666-00005-4: ±1% ±100ppm/℃ 10kΩ 0.1W 0603 Chip Resistor - Surface Mount ROHS; Manufacturer: Vishay Semiconductor; Manufacturer Part Number: CRCW060310K0FKEA; Voltage Rating: 75 V; Resistance: 10kR; Power Rating: 100mW; Temperature Coefficient: 100ppm/°C; Voltage Rating (DC): 75V; Max Operating Temperature: 155 degC; PackageDescription: 2-Pin Surface Mount Device, Body 1.575 x 0.85 mm; ComponentLink1Description: Manufacturer URL; RoHSCompliant: true; PackageReference: 0603; REACH SVHC: Unknown; Length: 1.55 mm; DatasheetVersion: 06/2012; Packaging: Tape and Reel; Min Operating Temperature: -55 degC; Mounting Technology: Surface Mount; ComponentLink2URL: https://datasheet.ciiva.com/11809/0900766b80d98afc-11809037.pdf; Height: 0.45 mm; ComponentLink2Description: Datasheet; Package Quantity: 5000; ComponentLink1URL: http://www.vishay.com/; Supplier 1: Future Electronics; Supplier Part Number 1: 8926099; RoHS: Yes; Category: Chip SMD Resistors; Stock 1: 2665000; Pricing 1: 5000=0.00790 (USD); Case/Package: 0603; Number of Pins: 2; Case Code (Metric): 1608; Case Code (Imperial): 0603; Contact Plating: Tin,Lead; Weight: 7.1E-05oz; Size Code: 0603; Tolerance: 1%; Max Power Dissipation: 100mW; Series: CRCW; Resistance Tolerance: 1%; Termination: SMD/SMT; Resistor Type: Thick Film; Number of Terminations: 2; Construction: Rectangular; Features: Automotive AEC-Q200; Technology: THICK FILM; Width: 0.033inch; Depth: 0.85mm; Radiation Hardening: No; Lead Free: Lead Free; RoHS Compliant: Yes; Military Standard: Not; ComponentLink3URL: https://datasheet.ciiva.com/11809/0900766b80d98afc-11809037.pdf?src-supplier=RSComponents; ComponentLink3Description: https://datasheet.ciiva.com/11809/0900766b80d98afc-11809037.pdf?src-supplier=RSComponents; ComponentLink4URL: https://datasheet.ciiva.com/16886/dcrcw-16886037.pdf?src-supplier=Avnet+Europe; ComponentLink4Description: https://datasheet.ciiva.com/16886/dcrcw-16886037.pdf?src-supplier=Avnet+Europe; ComponentLink5URL: https://datasheet.ciiva.com/26821/getdatasheetpartid-86831-26821109.pdf?src-supplier=Verical; ComponentLink5Description: https://datasheet.ciiva.com/26821/getdatasheetpartid-86831-26821109.pdf?src-supplier=Verical; ComponentLink6URL: https://datasheet.ciiva.com/16754/70201119-16754710.pdf?src-supplier=Allied+Electronics; ComponentLink6Description: https://datasheet.ciiva.com/16754/70201119-16754710.pdf?src-supplier=Allied+Electronics; ComponentLink7URL: https://datasheet.ciiva.com/16719/70201119-16719704.pdf?src-supplier=Allied+Electronics; ComponentLink7Description: https://datasheet.ciiva.com/16719/70201119-16719704.pdf?src-supplier=Allied+Electronics; ComponentLink8URL: https://datasheet.ciiva.com/2465/dcrcwe3-2465513.pdf?src-supplier=Digi-Key; ComponentLink8Description: https://datasheet.ciiva.com/2465/dcrcwe3-2465513.pdf?src-supplier=Digi-Key; ComponentLink9URL: https://datasheet.ciiva.com/5543/dcrcwe3-109170-5543001.pdf?src-supplier=Mouser; ComponentLink9Description: https://datasheet.ciiva.com/5543/dcrcwe3-109170-5543001.pdf?src-supplier=Mouser; ComponentLink10URL: https://datasheet.ciiva.com/2465/dcrcwe3-2465514.pdf?src-supplier=Digi-Key; ComponentLink10Description: https://datasheet.ciiva.com/2465/dcrcwe3-2465514.pdf?src-supplier=Digi-Key; ComponentLink11URL: https://datasheet.ciiva.com/46385/1697337-46385498.pdf?src-supplier=Element14; ComponentLink11Description: https://datasheet.ciiva.com/46385/1697337-46385498.pdf?src-supplier=Element14; ComponentLink12URL: https://datasheet.ciiva.com/2465/dcrcwe3-2465515.pdf?src-supplier=Digi-Key; ComponentLink12Description: https://datasheet.ciiva.com/2465/dcrcwe3-2465515.pdf?src-supplier=Digi-Key; ComponentLink13URL: https://datasheet.ciiva.com/3256/dcrcwe3-3256939.pdf?src-supplier=Avnet; ComponentLink13Description: https://datasheet.ciiva.com/3256/dcrcwe3-3256939.pdf?src-supplier=Avnet; ComponentLink14URL: https://datasheet.ciiva.com/3256/dcrcwe3-3256940.pdf?src-supplier=Avnet; ComponentLink14Description: https://datasheet.ciiva.com/3256/dcrcwe3-3256940.pdf?src-supplier=Avnet; ComponentLink15URL: https://datasheet.ciiva.com/16209/dcrcwe3-16209164.pdf?src-supplier=Future+Electronics; ComponentLink15Description: https://datasheet.ciiva.com/16209/dcrcwe3-16209164.pdf?src-supplier=Future+Electronics; ComponentLink16URL: https://datasheet.ciiva.com/26314/fld-crcw-e3-data-en-26314749.pdf?src-supplier=Distrelec; ComponentLink16Description: https://datasheet.ciiva.com/26314/fld-crcw-e3-data-en-26314749.pdf?src-supplier=Distrelec; JLCPCB Part #: C25804
R4 = RES: ±1% 4.7kΩ ±100ppm/℃ 0.1W 0603 Chip Resistor - Surface Mount ROHS; Manufacturer: Panasonic; Part Number: ERJ-3EKF1602V; Parameter 1: *; JLCPCB Part #: C23162
R5 R12 R20 R26 R27 = CMP-2003-00835-1: PANASONIC ELECTRONIC COMPONENTS         ERJ8ENF3302V            Surface Mount Chip Resistor, Thick Film, AEC-Q200 ERJ8E Series, 33 kohm, 250 mW,  1%, 200 V; Manufacturer Part Number: ERJ-8ENF3302V; Resistance: 33kR; Temperature Coefficient: 100ppm/°C; Power Rating: 250mW; Voltage Rating: 200V; Manufacturer: Panasonic; Part Number: ERJ8ENF3302V; Supplier 1: Newark; Supplier Part Number 1: 73AC7929; RoHS: Yes; Category: Chip SMD Resistors; Stock 1: 95000; Pricing 1: 5000=0.01400, 10000=0.01300 (USD); Mount: Surface Mount; Case/Package: 1206; Number of Pins: 2; Case Code (Metric): 3216; Case Code (Imperial): 1206; Contact Plating: Tin; Weight: 0.000571oz; Min Operating Temperature: -55°C; Max Operating Temperature: 155°C; Tolerance: 1%; Packaging: Tape and Reel; Resistor Type: Thick Film; Series: ERJ; Number of Terminations: 2; Max Power Dissipation: 250mW; Construction: Rectangular; Termination: SMD/SMT; Resistance Tolerance: 1%; Technology: THICK FILM; Length: 3.2mm; Width: 0.063inch; Height: 0.6mm; Depth: 1.6mm; Radiation Hardening: No; RoHS Compliant: Yes; Military Standard: Not; REACH SVHC: No SVHC; ComponentLink1URL: https://datasheet.ciiva.com/7802/1678782-7802698.pdf?src-supplier=Element14; ComponentLink1Description: https://datasheet.ciiva.com/7802/1678782-7802698.pdf?src-supplier=Element14; ComponentLink2URL: https://datasheet.ciiva.com/22687/1678782-22687084.pdf?src-supplier=Element14; ComponentLink2Description: https://datasheet.ciiva.com/22687/1678782-22687084.pdf?src-supplier=Element14; ComponentLink3URL: https://datasheet.ciiva.com/9190/aoa0000ce2-9190686.pdf?src-supplier=Avnet; ComponentLink3Description: https://datasheet.ciiva.com/9190/aoa0000ce2-9190686.pdf?src-supplier=Avnet; ComponentLink4URL: https://datasheet.ciiva.com/7802/426256-7802463.pdf?src-supplier=Element14; ComponentLink4Description: https://datasheet.ciiva.com/7802/426256-7802463.pdf?src-supplier=Element14; ComponentLink5URL: https://datasheet.ciiva.com/16758/70260748-16758335.pdf?src-supplier=Allied+Electronics; ComponentLink5Description: https://datasheet.ciiva.com/16758/70260748-16758335.pdf?src-supplier=Allied+Electronics; ComponentLink6URL: https://datasheet.ciiva.com/24168/aoa0000ce2-24168303.pdf?src-supplier=Mouser; ComponentLink6Description: https://datasheet.ciiva.com/24168/aoa0000ce2-24168303.pdf?src-supplier=Mouser; ComponentLink7URL: https://datasheet.ciiva.com/30215/aoa0000ce2-30215919.pdf?src-supplier=Onlinecomponents.com; ComponentLink7Description: https://datasheet.ciiva.com/30215/aoa0000ce2-30215919.pdf?src-supplier=Onlinecomponents.com; ComponentLink8URL: https://datasheet.ciiva.com/46436/1678782-46436639.pdf?src-supplier=Element14; ComponentLink8Description: https://datasheet.ciiva.com/46436/1678782-46436639.pdf?src-supplier=Element14
R10 = CMP-2003-00929-1: ±1% ±100ppm/℃ 560Ω 0.1W 0603 Chip Resistor - Surface Mount ROHS; Manufacturer: KOA Speer; Part Number: RK73B2BTTD4R7J
R15 R259 = RES: ±1% ±100ppm/℃ 1kΩ 0.1W 0603 Chip Resistor - Surface Mount ROHS; Part Number: ERJ-3EKF1001V; Manufacturer: Panasonic; Manufacturer Part Number: ERJ3EKF1001V; Resistance: 1kR; Power Rating: 100mW; Voltage Rating: 75V; Temperature Coefficient: 100ppm/°C; Supplier 1: Future Electronics; Supplier Part Number 1: 3028514; RoHS: Yes; Category: Chip SMD Resistors; Stock 1: 430000; Pricing 1: 5000=0.01860, 10000=0.01510, 15000=0.01500, 20000=0.01490 (USD); Mount: Surface Mount; Case/Package: 0603; Number of Pins: 2; Case Code (Metric): 1608; Case Code (Imperial): 0603; Contact Plating: Tin; Size Code: 0603; Min Operating Temperature: -55°C; Max Operating Temperature: 155°C; Packaging: Tape and Reel; Tolerance: 1%; Termination: SMD/SMT; Package Quantity: 5000; Series: ERJ; Resistor Type: Thick Film; Max Power Dissipation: 100mW; Construction: Rectangular; Resistance Tolerance: 1%; Number of Terminations: 2; Features: Automotive AEC-Q200; Voltage Rating (DC): 75V; Technology: THICK FILM; Length: 1.6mm; Width: 0.8mm; Height: 0.45mm; Depth: 0.8mm; Radiation Hardening: No; REACH SVHC: No SVHC; Lead Free: Lead Free; RoHS Compliant: Yes; Military Standard: Not; ComponentLink1URL: https://datasheet.ciiva.com/16768/70260748-16768437.pdf?src-supplier=Allied+Electronics; ComponentLink1Description: https://datasheet.ciiva.com/16768/70260748-16768437.pdf?src-supplier=Allied+Electronics; ComponentLink2URL: https://datasheet.ciiva.com/16774/70260748-16774550.pdf?src-supplier=Allied+Electronics; ComponentLink2Description: https://datasheet.ciiva.com/16774/70260748-16774550.pdf?src-supplier=Allied+Electronics; ComponentLink3URL: https://datasheet.ciiva.com/16449/aoa0000ce2-16449065.pdf?src-supplier=Future+Electronics; ComponentLink3Description: https://datasheet.ciiva.com/16449/aoa0000ce2-16449065.pdf?src-supplier=Future+Electronics; ComponentLink4URL: https://datasheet.ciiva.com/7942/aoa0000ce2-7942427.pdf?src-supplier=Element14; ComponentLink4Description: https://datasheet.ciiva.com/7942/aoa0000ce2-7942427.pdf?src-supplier=Element14; ComponentLink5URL: https://datasheet.ciiva.com/9198/aoa0000ce2-9198923.pdf?src-supplier=Avnet; ComponentLink5Description: https://datasheet.ciiva.com/9198/aoa0000ce2-9198923.pdf?src-supplier=Avnet; ComponentLink6URL: https://datasheet.ciiva.com/46373/1678782-46373339.pdf?src-supplier=Element14; ComponentLink6Description: https://datasheet.ciiva.com/46373/1678782-46373339.pdf?src-supplier=Element14; ComponentLink7URL: https://datasheet.ciiva.com/48530/aoa0000ce2-48530987.pdf?src-supplier=Avnet; ComponentLink7Description: https://datasheet.ciiva.com/48530/aoa0000ce2-48530987.pdf?src-supplier=Avnet; ComponentLink8URL: https://datasheet.ciiva.com/46373/1678782-46373340.pdf?src-supplier=Element14; ComponentLink8Description: https://datasheet.ciiva.com/46373/1678782-46373340.pdf?src-supplier=Element14; ComponentLink9URL: https://datasheet.ciiva.com/24070/aoa0000ce2-24070269.pdf?src-supplier=Mouser; ComponentLink9Description: https://datasheet.ciiva.com/24070/aoa0000ce2-24070269.pdf?src-supplier=Mouser; ComponentLink10URL: https://datasheet.ciiva.com/22673/1678782-22673918.pdf?src-supplier=Element14; ComponentLink10Description: https://datasheet.ciiva.com/22673/1678782-22673918.pdf?src-supplier=Element14; ComponentLink11URL: https://datasheet.ciiva.com/30063/aoa0000ce2-30063390.pdf?src-supplier=Onlinecomponents.com; ComponentLink11Description: https://datasheet.ciiva.com/30063/aoa0000ce2-30063390.pdf?src-supplier=Onlinecomponents.com; ComponentLink12URL: https://datasheet.ciiva.com/17215/aoa0000ce2-17215311.pdf?src-supplier=Avnet+Europe; ComponentLink12Description: https://datasheet.ciiva.com/17215/aoa0000ce2-17215311.pdf?src-supplier=Avnet+Europe; Parameter 1: *; JLCPCB Part #: C21190
R17 = RES-2: ±1% 100kΩ ±100ppm/℃ 0.1W 0603 Chip Resistor - Surface Mount ROHS; Manufacturer: Yageo; Manufacturer Part Number: RC0603JR-071ML; Power Rating: 100mW; Resistance Tolerance: ±5%; Product Range: RCSeries; Temperature Coefficient: ±100ppm/°C; Resistor Element Type: ThickFilm; Resistance: 1Mohm; SVHC: ToBeAdvised; Voltage Rating: 50V; Resistor Case Style: 0603[1608Metric]; Tolerance: 5%; MSL: MSL1-Unlimited; Package Description: 2-Pin Surface Mount Device, Body 1.6 x 0.8 mm; Datasheet Version: Rev. 7, 05/2017; Datasheet URL: http://www.yageo.com/documents/recent/PYu-RC_Group_51_RoHS_L_7.pdf; Manufacturer URL: http://www.yageo.com/; Package Reference: 0603; Automotive Qualification Standard: -; Packaging: CutTape; Mounting Technology: SurfaceMount; Supplier 1: Digi-Key; Supplier Part Number 1: 311-1.0MGRCT-ND; Stock 1: 3949362; Pricing 1: 1=0,10000, 10=0,01900, 100=0,00770, 1000=0,00347, 2500=0,00301 (USD); RoHS: Yes; Case/Package: 0603; Number of Pins: 2; Case Code (Imperial): 0603; Case Code (Metric): 1608; Contact Plating: Tin,Matte; Min Operating Temperature: -55°C; Max Operating Temperature: 155°C; Composition: Thick Film; Termination: SMD/SMT; Package Quantity: 5000; Military Standard: Not; Voltage Rating (DC): 50V; Length: 1.6mm; Height: 0.45mm; Width: 0.8mm; Depth: 0.8mm; Radiation Hardening: No; Lead Free: Lead Free; REACH SVHC: No SVHC; ComponentLink1URL: https://datasheet.ciiva.com/46395/443971-46395067.pdf?src-supplier=Element14; ComponentLink1Description: https://datasheet.ciiva.com/46395/443971-46395067.pdf?src-supplier=Element14; ComponentLink2URL: https://datasheet.ciiva.com/8883/pyu-rc0603-51-rohs-l-4-8883053.pdf?src-supplier=Avnet; ComponentLink2Description: https://datasheet.ciiva.com/8883/pyu-rc0603-51-rohs-l-4-8883053.pdf?src-supplier=Avnet; ComponentLink3URL: https://datasheet.ciiva.com/12555/rc0603-272842-12555342.pdf?src-supplier=Mouser; ComponentLink3Description: https://datasheet.ciiva.com/12555/rc0603-272842-12555342.pdf?src-supplier=Mouser; ComponentLink4URL: https://datasheet.ciiva.com/7746/443971-7746463.pdf?src-supplier=Element14; ComponentLink4Description: https://datasheet.ciiva.com/7746/443971-7746463.pdf?src-supplier=Element14; Parameter 1: *; JLCPCB Part #: C25803